# EasyEDA schematic Проектная смена 2026.json
TITLE: Sheet_1; REV: 1.0; Date: 2026-04-09; Sheet: 1/1; Drawn By: danik_mus; Company: Your Company
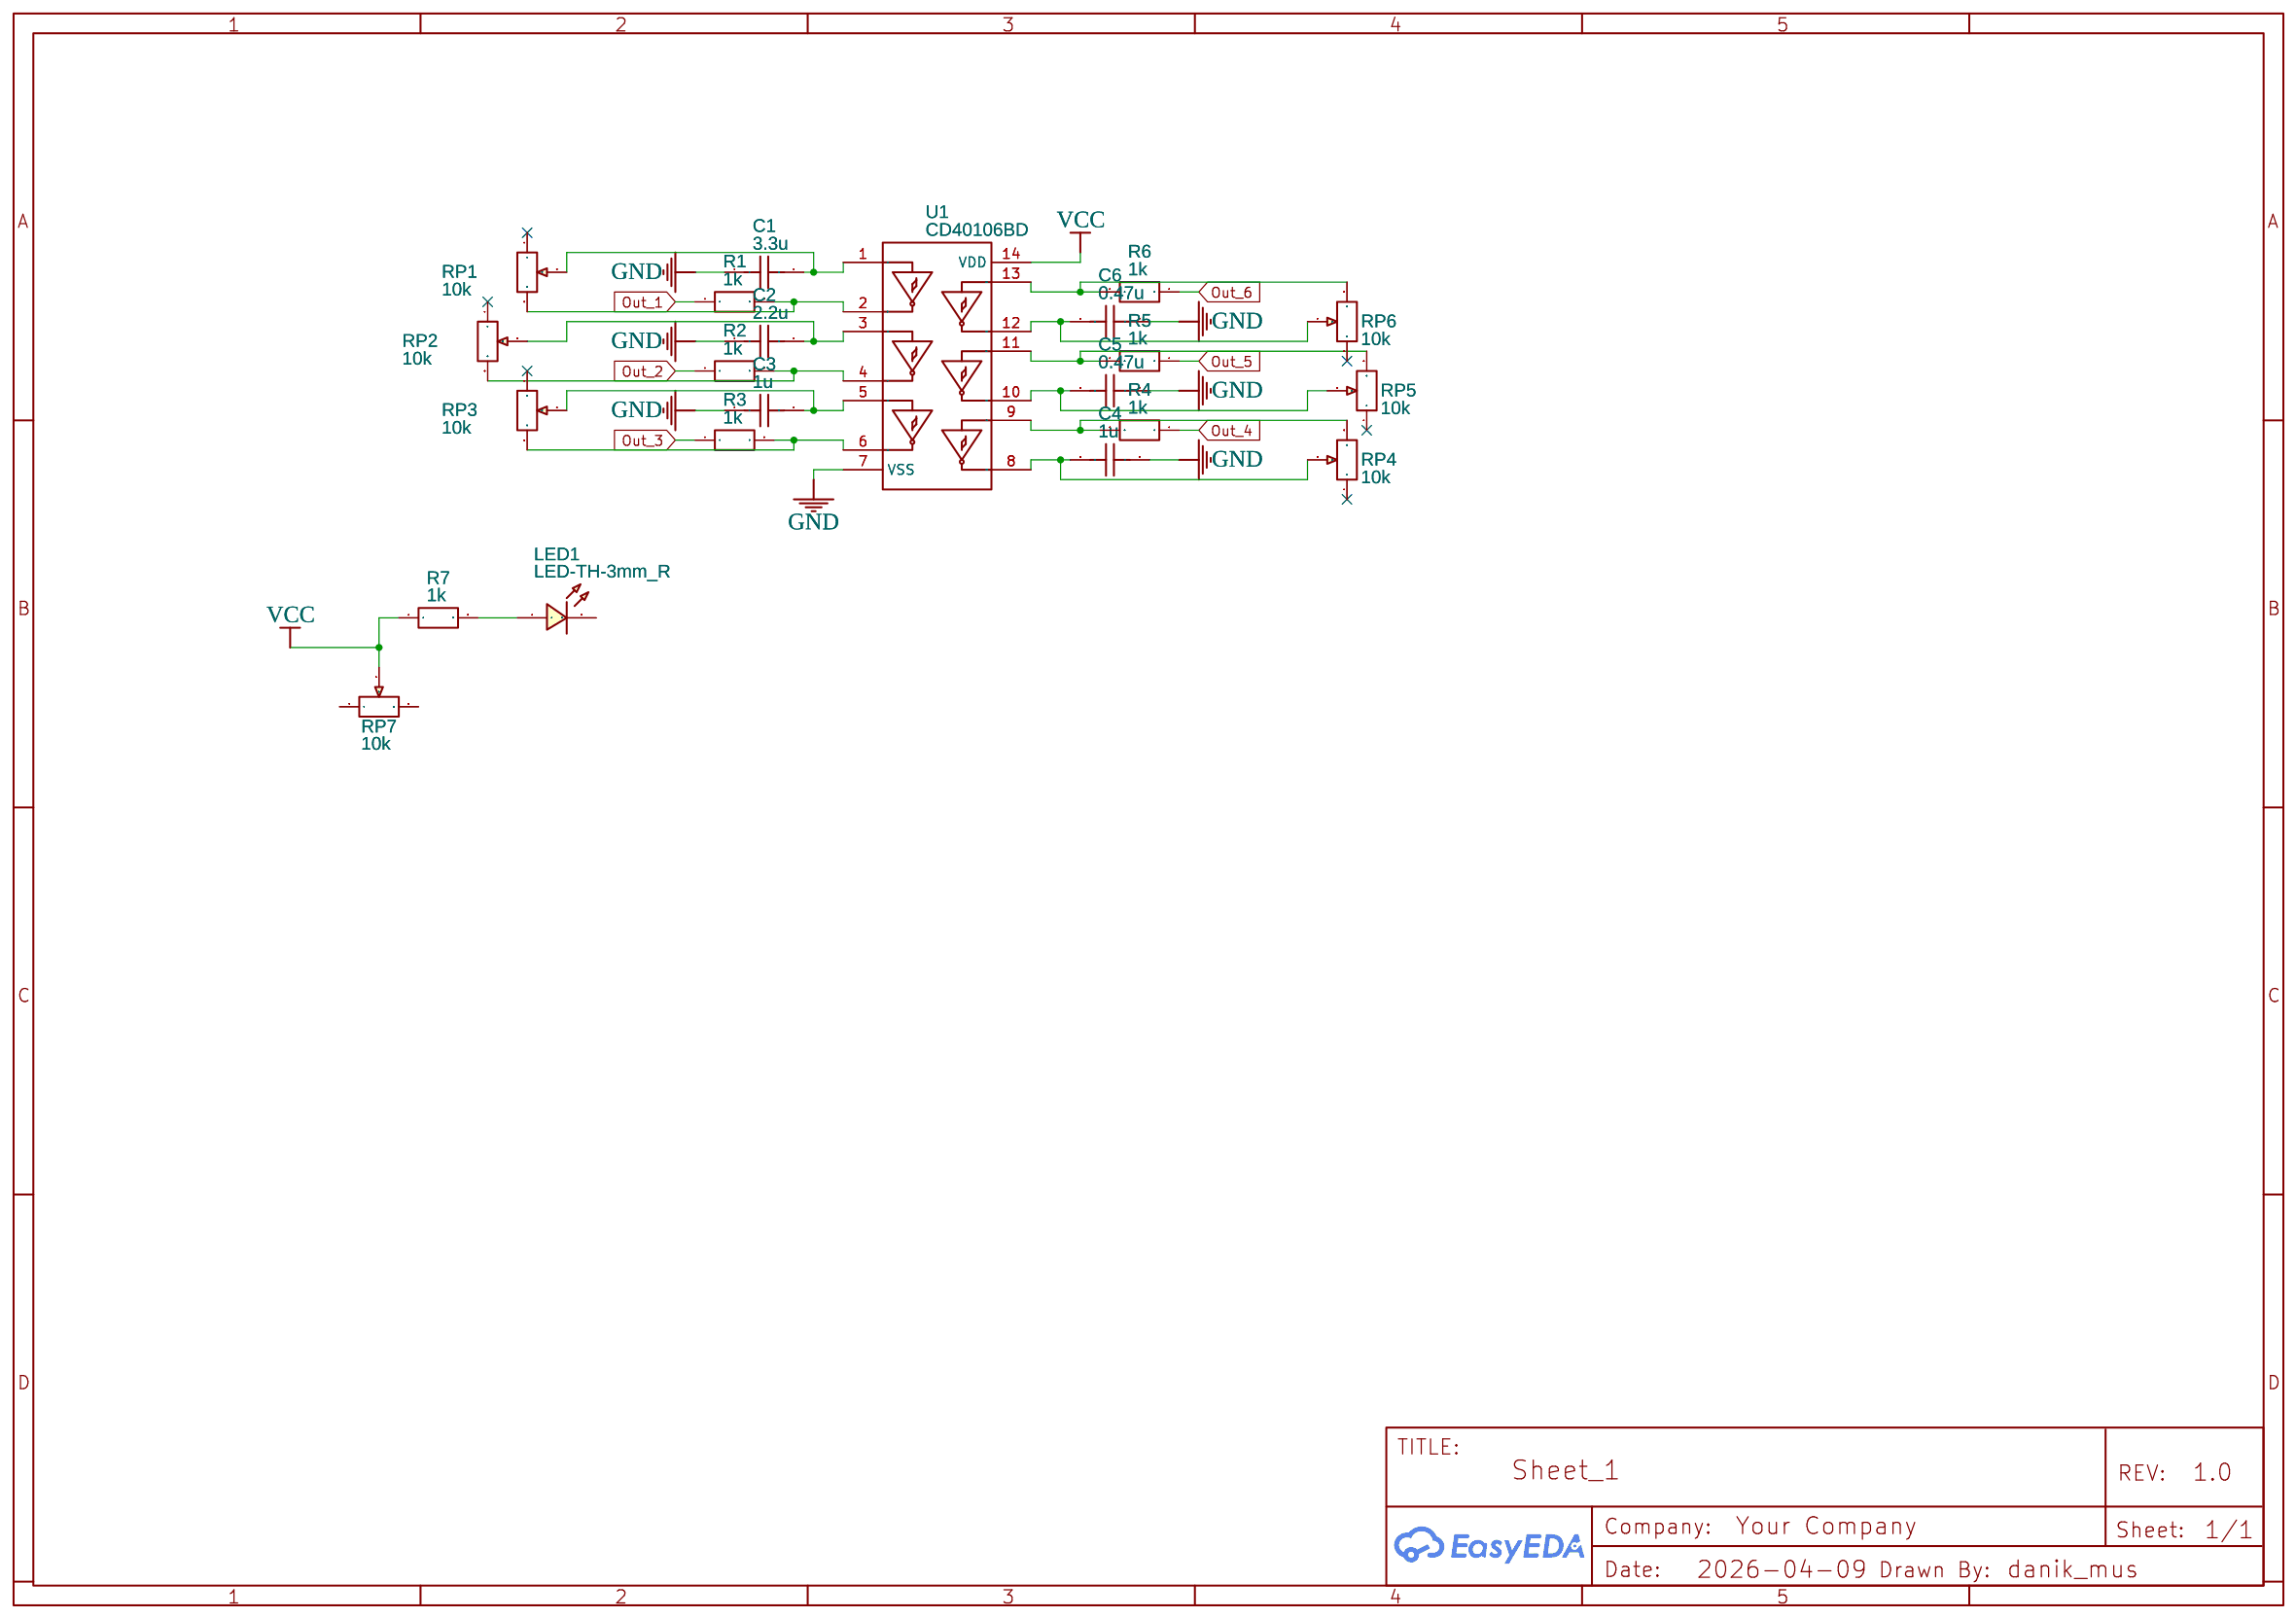
[diagram p0: schematic sheet]

## Parts
C1  3.3u  [C0603]
C2  2.2u  [C0603]
C3  1u  [C0603]
C4  1u  [C0603]
C5  0.47u  [C0603]
C6  0.47u  [C0603]
LED1  LED-TH-3mm_R  [LED-TH_BD3.0_RED]
R1  1k  [R_AXIAL-1.0]
R2  1k  [R_AXIAL-1.0]
R3  1k  [R_AXIAL-1.0]
R4  1k  [R_AXIAL-1.0]
R5  1k  [R_AXIAL-1.0]
R6  1k  [R_AXIAL-1.0]
R7  1k  [R_AXIAL-1.0]
RP1  10k  [ПОТЕНЦИОМЕТР]
RP2  10k  [ПОТЕНЦИОМЕТР]
RP3  10k  [ПОТЕНЦИОМЕТР]
RP4  10k  [ПОТЕНЦИОМЕТР]
RP5  10k  [ПОТЕНЦИОМЕТР]
RP6  10k  [ПОТЕНЦИОМЕТР]
RP7  10k  [ПОТЕНЦИОМЕТР]
U1  CD40106BD  [DIP-14_L19.1-W6.4-P2.54-LS7.6-BL]

## Library data of the parts
C1-C6 = C_0603_US: Contributor: LCEDA_Lib
LED1 = LED-TH-3mm_R: Manufacturer: EVERLIGHT(台湾亿光); Manufacturer Part: 204-10SDRD/S530-A3-L; Supplier Part: C84774; Supplier: LCSC; Contributor: LCEDA_Lib
R1-R7 = R_AXIAL-1.0_EU: Contributor: LCEDA_Lib
RP1-RP7 = POTRES COPY COPY: Contributor: ttnigmatyllin
U1 = CD40106BD: Supplier: LCSC; Supplier Part: C5274709; Manufacturer: Sungine(双竞集成); Contributor: lcsc

## Nets
GND: C1.1 C2.1 C3.1 C4.1 C5.1 C6.1 U1.7(VSS)
VCC: R7.1 RP7.2 U1.14(VDD)
Out_1: R1.1
Out_2: R2.1
Out_3: R3.1
Out_4: R4.1
Out_5: R5.1
Out_6: R6.1
Net-(C1-2): C1.2 RP1.2 U1.1
Net-(C2-2): C2.2 RP2.2 U1.3
Net-(C3-2): C3.2 RP3.2 U1.5
Net-(C4-2): C4.2 RP4.2 U1.8
Net-(C5-2): C5.2 RP5.2 U1.10
Net-(C6-2): C6.2 RP6.2 U1.12
Net-(LED1-1): LED1.1 R7.2
Net-(R1-2): R1.2 RP1.3 U1.2
Net-(R2-2): R2.2 RP2.3 U1.4
Net-(R3-2): R3.2 RP3.3 U1.6
Net-(R4-2): R4.2 RP4.3 U1.9
Net-(R5-2): R5.2 RP5.3 U1.11
Net-(R6-2): R6.2 RP6.3 U1.13

Not connected (* = marked no-connect by the designer): LED1 2; RP1 1*; RP2 1*; RP3 1*; RP4 1*; RP5 1*; RP6 1*; RP7 1 3
